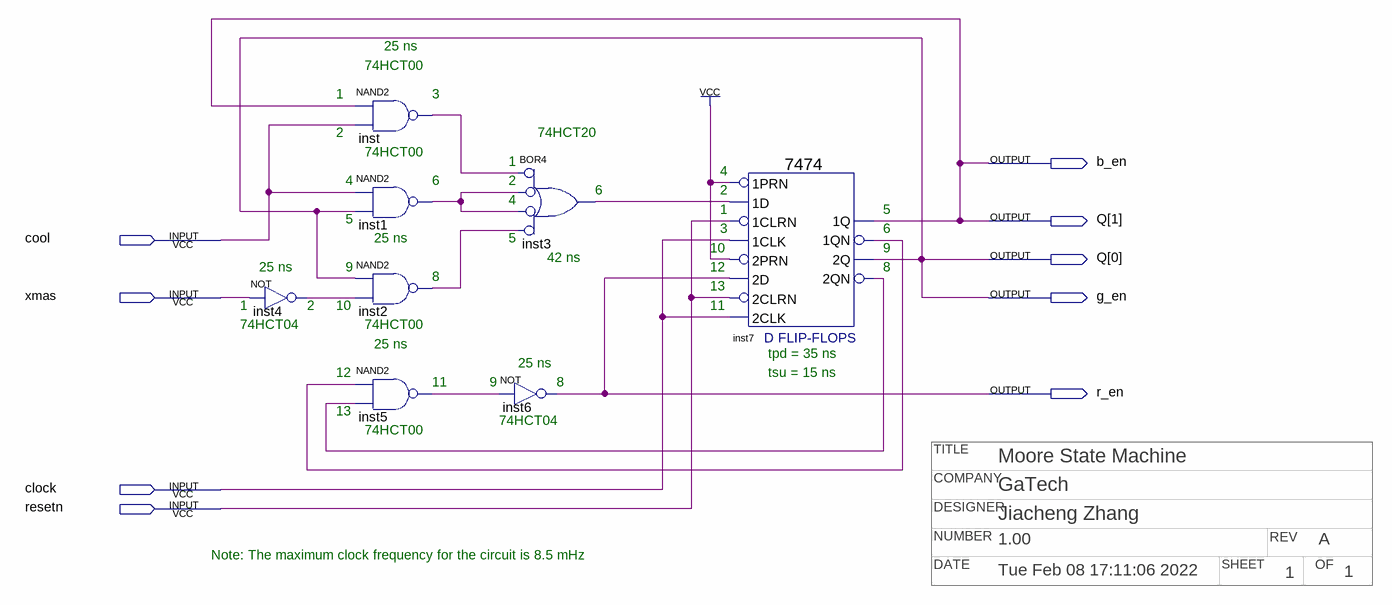
[diagram p0: schematic sheet]
// Quartus schematic MooreStateMachine.bdf as structural Verilog: 8 symbols, 9 pins
// Title block: COMPANY: GaTech; DATE: Tue Feb 08 17:11:06 2022; DESIGNER: Jiacheng Zhang; NUMBER: 1.00; OF: 1; REV: A; SHEET: 1; TITLE: Moore State Machine
module MooreStateMachine (
  input  cool,
  input  xmas,
  input  clock,
  input  resetn,
  output b_en,
  output [1:0] Q,
  output g_en,
  output r_en
);

  wire inst1_out, inst2_out, inst3_out, inst4_out, inst5_out, inst7_1qn, inst7_2qn, inst_out;

  not inst4 (inst4_out, xmas);
  nand inst (inst_out, b_en, cool);
  nand inst1 (inst1_out, cool, g_en);
  nand inst2 (inst2_out, g_en, inst4_out);
  nand inst5 (inst5_out, inst7_1qn, inst7_2qn);
  or inst3 (inst3_out, ~inst_out, ~inst1_out, ~inst1_out, ~inst2_out);  // BOR4
  not inst6 (r_en, inst5_out);
  \7474  inst7 (
    .\2D (r_en), .\2PRN (1'b1), .\1CLK (clock), .\1D (inst3_out), .\1PRN (1'b1), .\2CLK (clock),
    .\2CLRN (resetn), .\1CLRN (resetn), .\1QN (inst7_1qn), .\2Q (g_en), .\2QN (inst7_2qn), .\1Q (b_en));

  assign Q = {b_en, g_en};

  // Notes on the sheet:
  //   25 ns
  //   74HCT00
  //   1
  //   3
  //   2
  //   74HCT20
  //   74HCT00
  //   1
  //   4
  //   4
  //   6
  //   2
  //   6
  //   2
  //   4
  //   1
  //   5
  //   5
  //   3
  //   6
  //   25 ns
  //   5
  //   10
  //   9
  //   42 ns
  //   25 ns
  //   9
  //   12
  //   8
  //   8
  //   13
  //   1
  //   2
  //   10
  //   11
  //   74HCT04
  //   74HCT00
  //   25 ns
  //   tpd = 35 ns
  //   25 ns
  //   12
  //   tsu = 15 ns
  //   11
  //   9
  //   8
  //   13
  //   74HCT04
  //   74HCT00
  //   Note: The maximum clock frequency for the circuit is 8.5 mHz
endmodule
